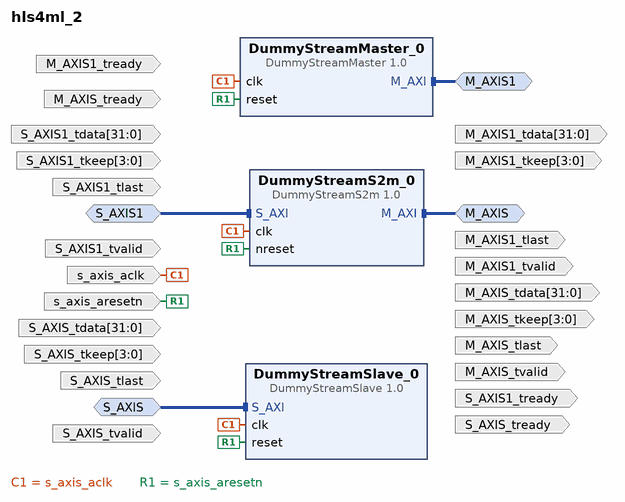
[diagram p0: block diagram of the top level]
# Vivado block design hls4ml_2, xck26-sfvc784-2LV-c, Vivado 2023.2
create_bd_design hls4ml_2

create_bd_intf_port -mode Master -vlnv xilinx.com:interface:axis_rtl:1.0 M_AXIS
set_property -dict [list \
  CONFIG.CLK_DOMAIN system_zynq_ultra_ps_e_0_0_pl_clk0 \
  CONFIG.FREQ_HZ 99999001 \
  CONFIG.HAS_TKEEP 1 \
  CONFIG.HAS_TLAST 1 \
  CONFIG.HAS_TREADY 1 \
  CONFIG.HAS_TSTRB 0 \
  CONFIG.INSERT_VIP 0 \
  CONFIG.LAYERED_METADATA undef \
  CONFIG.PHASE 0.0 \
  CONFIG.TDATA_NUM_BYTES 4 \
  CONFIG.TDEST_WIDTH 0 \
  CONFIG.TID_WIDTH 0 \
  CONFIG.TUSER_WIDTH 0 \
] [get_bd_intf_ports M_AXIS]
create_bd_intf_port -mode Master -vlnv xilinx.com:interface:axis_rtl:1.0 M_AXIS1
set_property -dict [list \
  CONFIG.CLK_DOMAIN system_zynq_ultra_ps_e_0_0_pl_clk0 \
  CONFIG.FREQ_HZ 99999001 \
  CONFIG.HAS_TKEEP 1 \
  CONFIG.HAS_TLAST 1 \
  CONFIG.HAS_TREADY 1 \
  CONFIG.HAS_TSTRB 0 \
  CONFIG.INSERT_VIP 0 \
  CONFIG.LAYERED_METADATA undef \
  CONFIG.PHASE 0.0 \
  CONFIG.TDATA_NUM_BYTES 4 \
  CONFIG.TDEST_WIDTH 0 \
  CONFIG.TID_WIDTH 0 \
  CONFIG.TUSER_WIDTH 0 \
] [get_bd_intf_ports M_AXIS1]
create_bd_intf_port -mode Slave -vlnv xilinx.com:interface:axis_rtl:1.0 S_AXIS
set_property -dict [list \
  CONFIG.CLK_DOMAIN system_zynq_ultra_ps_e_0_0_pl_clk0 \
  CONFIG.FREQ_HZ 99999001 \
  CONFIG.HAS_TKEEP 1 \
  CONFIG.HAS_TLAST 1 \
  CONFIG.HAS_TREADY 1 \
  CONFIG.HAS_TSTRB 0 \
  CONFIG.INSERT_VIP 0 \
  CONFIG.LAYERED_METADATA undef \
  CONFIG.PHASE 0.0 \
  CONFIG.TDATA_NUM_BYTES 4 \
  CONFIG.TDEST_WIDTH 0 \
  CONFIG.TID_WIDTH 0 \
  CONFIG.TUSER_WIDTH 0 \
] [get_bd_intf_ports S_AXIS]
create_bd_intf_port -mode Slave -vlnv xilinx.com:interface:axis_rtl:1.0 S_AXIS1
set_property -dict [list \
  CONFIG.CLK_DOMAIN system_zynq_ultra_ps_e_0_0_pl_clk0 \
  CONFIG.FREQ_HZ 99999001 \
  CONFIG.HAS_TKEEP 1 \
  CONFIG.HAS_TLAST 1 \
  CONFIG.HAS_TREADY 1 \
  CONFIG.HAS_TSTRB 0 \
  CONFIG.INSERT_VIP 0 \
  CONFIG.LAYERED_METADATA undef \
  CONFIG.PHASE 0.0 \
  CONFIG.TDATA_NUM_BYTES 4 \
  CONFIG.TDEST_WIDTH 0 \
  CONFIG.TID_WIDTH 0 \
  CONFIG.TUSER_WIDTH 0 \
] [get_bd_intf_ports S_AXIS1]
create_bd_port -dir O -from 31 -to 0 M_AXIS_tdata
create_bd_port -dir O -from 3 -to 0 M_AXIS_tkeep
create_bd_port -dir O M_AXIS_tlast
create_bd_port -dir I M_AXIS_tready
create_bd_port -dir O M_AXIS_tvalid
create_bd_port -dir O -from 31 -to 0 M_AXIS1_tdata
create_bd_port -dir O -from 3 -to 0 M_AXIS1_tkeep
create_bd_port -dir O M_AXIS1_tlast
create_bd_port -dir I M_AXIS1_tready
create_bd_port -dir O M_AXIS1_tvalid
create_bd_port -dir I -from 31 -to 0 S_AXIS_tdata
create_bd_port -dir I -from 3 -to 0 S_AXIS_tkeep
create_bd_port -dir I S_AXIS_tlast
create_bd_port -dir O S_AXIS_tready
create_bd_port -dir I S_AXIS_tvalid
create_bd_port -dir I -from 31 -to 0 S_AXIS1_tdata
create_bd_port -dir I -from 3 -to 0 S_AXIS1_tkeep
create_bd_port -dir I S_AXIS1_tlast
create_bd_port -dir O S_AXIS1_tready
create_bd_port -dir I S_AXIS1_tvalid
create_bd_port -dir I -type clk s_axis_aclk
set_property -dict [list \
  CONFIG.ASSOCIATED_BUSIF M_AXIS:M_AXIS1:S_AXIS:S_AXIS1 \
  CONFIG.ASSOCIATED_CLKEN s_axis_aclken \
  CONFIG.ASSOCIATED_RESET s_axis_aresetn \
  CONFIG.CLK_DOMAIN system_zynq_ultra_ps_e_0_0_pl_clk0 \
  CONFIG.FREQ_HZ 99999001 \
  CONFIG.FREQ_TOLERANCE_HZ 0 \
  CONFIG.INSERT_VIP 0 \
  CONFIG.PHASE 0.0 \
] [get_bd_ports s_axis_aclk]
create_bd_port -dir I -type rst s_axis_aresetn
set_property -dict {CONFIG.INSERT_VIP 0 CONFIG.POLARITY ACTIVE_LOW CONFIG.TYPE INTERCONNECT} [get_bd_ports s_axis_aresetn]

create_bd_cell -type ip -vlnv user.org:user:DummyStreamMaster:1.0 DummyStreamMaster_0
create_bd_cell -type ip -vlnv user.org:user:DummyStreamSlave:1.0 DummyStreamSlave_0
create_bd_cell -type ip -vlnv user.org:user:DummyStreamS2m:1.0 DummyStreamS2m_0

# ---- connections ----

connect_bd_intf_net [get_bd_intf_ports M_AXIS1] [get_bd_intf_pins DummyStreamMaster_0/M_AXI]
connect_bd_intf_net [get_bd_intf_ports M_AXIS] [get_bd_intf_pins DummyStreamS2m_0/M_AXI]
connect_bd_intf_net -intf_net S_AXIS1_1 [get_bd_intf_ports S_AXIS1] [get_bd_intf_pins DummyStreamS2m_0/S_AXI]
connect_bd_intf_net [get_bd_intf_ports S_AXIS] [get_bd_intf_pins DummyStreamSlave_0/S_AXI]
connect_bd_net [get_bd_ports s_axis_aclk] \
  [get_bd_pins DummyStreamMaster_0/clk] [get_bd_pins DummyStreamSlave_0/clk] [get_bd_pins DummyStreamS2m_0/clk]
connect_bd_net [get_bd_ports s_axis_aresetn] \
  [get_bd_pins DummyStreamMaster_0/reset] [get_bd_pins DummyStreamSlave_0/reset] [get_bd_pins DummyStreamS2m_0/nreset]

validate_bd_design
save_bd_design
